# EAGLE design brain (EAGLE 5.01)
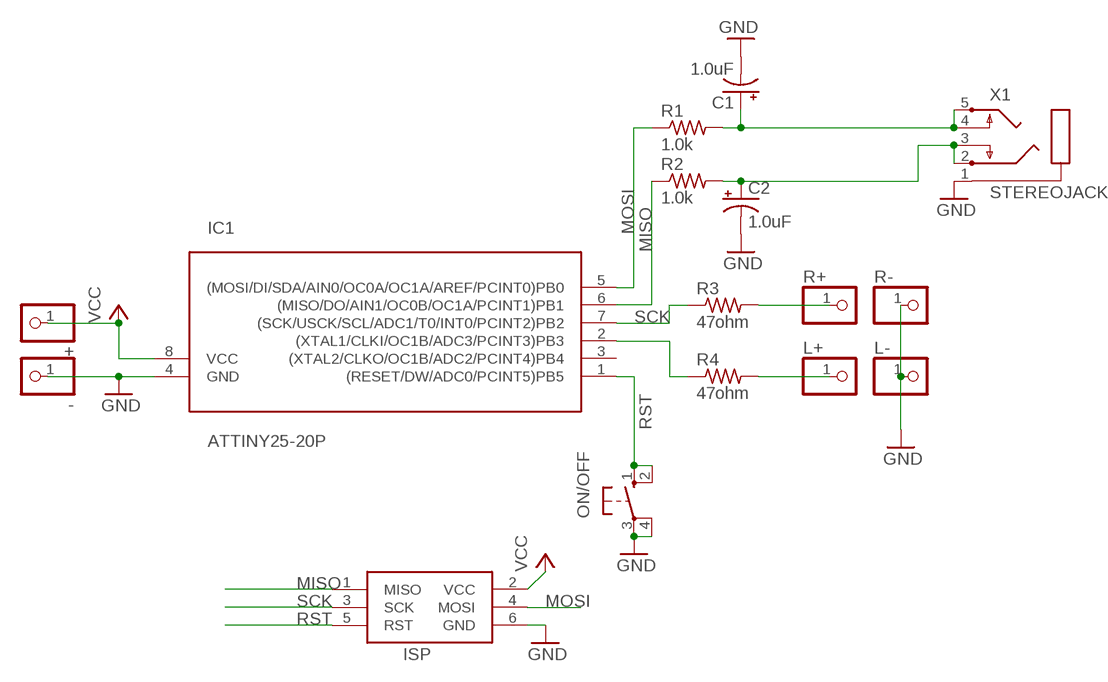
[diagram p0: schematic, sheet 1]

## Parts
+  PINHD-1X1  [1X01]
-  PINHD-1X1  [1X01]
C1  1.0uF  CPOL-USE2.5-5  [E2,5-5]
C2  1.0uF  CPOL-USE2.5-5  [E2,5-5]
IC1  ATTINY25-20P  [DIL08]
ISP  AVRISP-6  [AVRISP]
L+  PINHD-1X1  [1X01]
L-  PINHD-1X1  [1X01]
ON/OFF  10-XX  [B3F-10XX]
R1  1.0k  R-US_0207/10  [0207/10]
R2  1.0k  R-US_0207/10  [0207/10]
R3  47ohm  R-US_0207/10  [0207/10]
R4  47ohm  R-US_0207/10  [0207/10]
R+  PINHD-1X1  [1X01]
R-  PINHD-1X1  [1X01]
X1  STEREOJACK  [STX3100]

## Nets
GND: -.1 C1.- C2.- IC1.4(GND) ISP.6(GND) L-.1 ON/OFF.3(P) ON/OFF.4(P1) R-.1 X1.1
LEYE+: L+.1 R4.2
MISO: IC1.6((MISO/DO/AIN1/OC0B/OC1A/PCINT1)PB1) ISP.1(MISO) R2.1
MOSI: IC1.5((MOSI/DI/SDA/AIN0/OC0A/OC1A/AREF/PCINT0)PB0) ISP.4(MOSI) R1.1
N$1: C1.+ R1.2 X1.4 X1.5
N$3: C2.+ R2.2 X1.2 X1.3
N$8: IC1.2((XTAL1/CLKI/OC1B/ADC3/PCINT3)PB3) R4.1
N$9: R3.2 R+.1
RST: IC1.1((RESET/DW/ADC0/PCINT5)PB5) ISP.5(RST) ON/OFF.1(S) ON/OFF.2(S1)
SCK: IC1.7((SCK/USCK/SCL/ADC1/T0/INT0/PCINT2)PB2) ISP.3(SCK) R3.1
VCC: +.1 IC1.8(VCC) ISP.2(VCC)
Unconnected: IC1.3((XTAL2/CLKO/OC1B/ADC2/PCINT4)PB4)

## Library data of the parts
+ - L+ L- R+ R- = adafruit:PINHD-1X1: Pin header 1x1 for 0.1" spacing With round pins
C1 C2 = adafruit:CPOL-US: POLARIZED CAPACITOR, American symbol
IC1 = avr:ATTINY25: MICROCONTROLLER 2 Kbytes FLASH 128 bytes EEPROM 128 bytes RAM 4-channel 10 bit ADC USI
ISP = adafruit:AVRISP: AVR ISP HEADER Standard 6 pin header for AVR programming
ON/OFF = switch-omron:10-XX: OMRON SWITCH
R1-R4 = adafruit:R-US_: RESISTOR, American symbol
X1 = adafruit:STEREOJACK: MIC/HEADPHONE JACK Stereo jack with two switches. Kycon STX3100, CUI SJ1-3555NG and/or 4UCon 05544

## Board
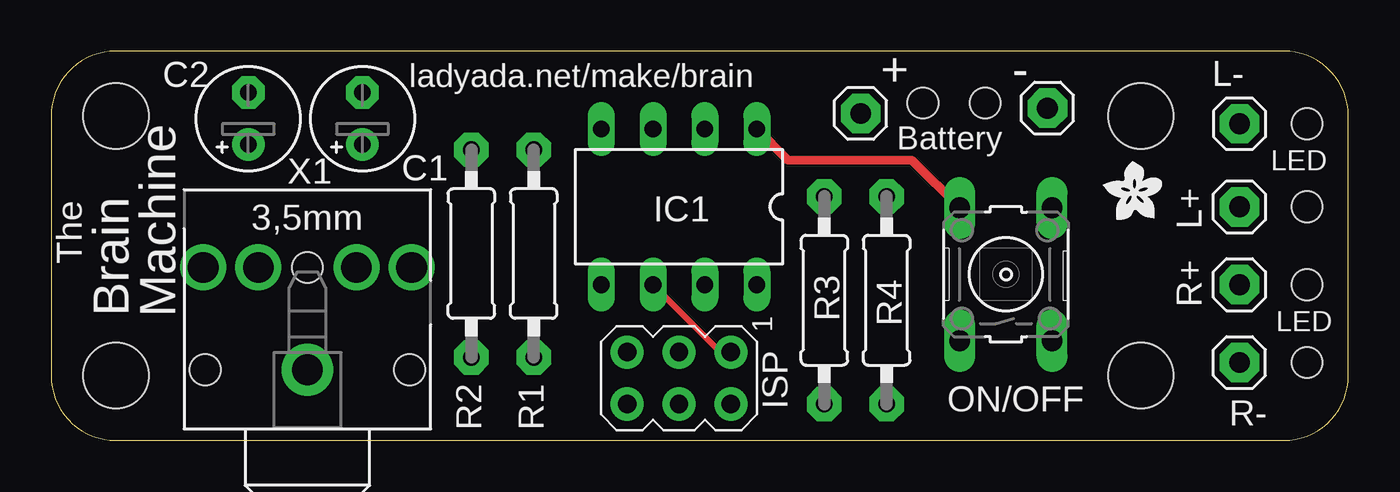
[diagram p1: board, top side]
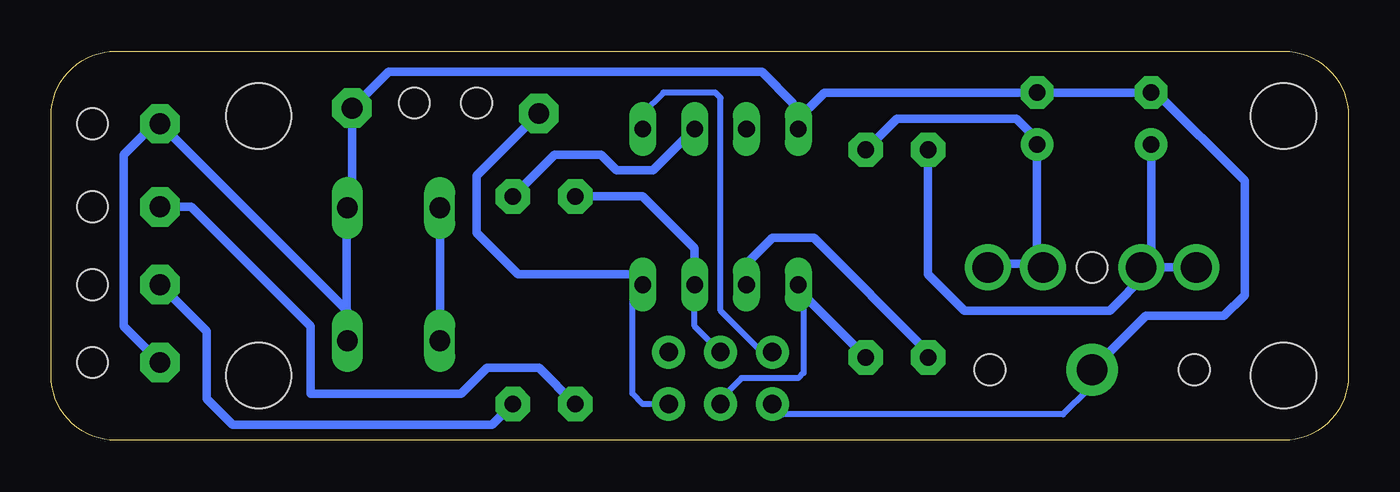
[diagram p2: board, bottom side, seen from below]

Size 63.5 x 19.05 mm. Coordinates in mm from the lower left corner, seen from the top.
Outline: 60.33,0 arc90 63.5,3.17 63.5,15.88 arc90 60.33,19.05 3.17,19.05 arc90 0,15.88 0,3.17 arc90 3.17,0 60.33,0
Copper layers (1*16): Top 0.035mm / dielectric 1.5mm / Bottom 0.035mm
Design rules "default *": minimum track width 10mil, minimum drill 19mil, track to track 12mil, track to pad 12mil, pad to pad 12mil, via to via 12mil, smd to smd 8mil, copper to edge 20mil, drill to drill 8mil, minimum pad ring 10mil, minimum via ring 8mil, stop-mask expansion 4mil, vias tented up to drill 0mil, thermal gap 10mil
Holes 3.2 mm at 3.17,3.17 3.17,15.88 53.34,15.88 53.34,3.17
Holes 1.5 mm at 45.72,16.51 42.67,16.51 61.47,15.49 61.47,11.43 61.47,7.62 61.47,3.81

### Footprints (pad centres in the part's own frame; a part is rotated, then mirrored left to right if it is on the bottom)
1X01 = drill 1.016 pad 1.93 octagon: 1 0,0
E2,5-5 = drill 0.813 pad 1.6 round: + -1.27,0 | drill 0.813 pad 1.6 octagon: - 1.27,0
DIL08 = drill 0.813 long: 1 -3.81,-3.81; 2 -1.27,-3.81; 3 1.27,-3.81; 4 3.81,-3.81; 5 3.81,3.81; 6 1.27,3.81; 7 -1.27,3.81; 8 -3.81,3.81
AVRISP = drill 0.9 pad 1.626 round: 1 -1.27,2.54; 2 1.27,2.54; 3 -1.27,0; 4 1.27,0; 5 -1.27,-2.54; 6 1.27,-2.54
B3F-10XX = drill 1.016 long: 1 -3.251,2.261; 2 3.251,2.261; 3 -3.251,-2.261; 4 3.251,-2.261
0207/10 = drill 0.813 pad 1.676 octagon: 1 -5.08,0; 2 5.08,0
STX3100 = drill 1.5 pad 2.54 round: 1 2.7,-0.1 | drill 1.5 round: 2 7.7,5; 3 7.7,2.3; 4 7.7,-2.5; 5 7.7,-5.2 | hole 1.5: 2.7,4.9; 2.7,-5.1; 7.7,-0.1

### Placement (x,y rotation side)
+  39.62,16 180 top
-  48.77,16.26 180 top
C1  15.24,15.75 90 top
C2  9.65,15.75 90 top
IC1  30.73,11.43 180 top
ISP  30.73,3.05 270 top
L+  58.17,7.62 90 top
L-  58.17,15.49 0 top
ON/OFF  46.74,8.13 90 top
R1  23.62,9.14 90 top
R2  20.57,9.14 90 top
R3  37.85,6.86 270 top
R4  40.89,6.86 270 top
R+  58.17,11.43 90 top
R-  58.17,3.81 180 top
U$1  [ADAFRUIT200MIL]  52.83,12.19 0 top
X1  12.45,0.76 90 top

### Tracks (layer width: path | path; a pad name or v marks a point on that pad's centre or on a via)
GND
  Bottom 0.305: ISP.6 27.69,1.27 13.97,1.27 12.7,2.54 12.7,3.31 X1.1
  Bottom 0.406: X1.1 9.91,6.1 6.1,6.1 5.08,7.11 5.08,12.7 9.4,17.02 C2.- C1.- | C1.- 15.49,17.02 | C1.- 25.65,17.02 27.18,15.49 | R-.1 59.94,5.59 59.94,13.97 58.42,15.49 L-.1 49,6.33 ON/OFF.3 49.02,4.9 49.02,11.4 | 49.02,11.4 49.02,11.68 | 49.02,11.4 ON/OFF.4 48.82,11.38 48.77,11.68 -.1 46.99,18.03 28.7,18.03 27.18,16.51 27.18,15.49 | 27.18,15.49 IC1.4
LEYE+
  Bottom 0.406: R4.2 41.91,0.76 54.61,0.76 55.88,2.03 55.88,5.33 57.91,7.37 58.17,7.37 L+.1
MISO
  Top 0.305: ISP.1 32.77,4.32 IC1.6
  Bottom 0.406: R2.1 20.57,4.32 26.16,9.91 28.19,9.91 29.46,8.64 IC1.6
MOSI
  Bottom 0.305: 26.92,7.37 26.67,7.11 26.67,3.3 26.92,3.05 29.72,3.05 30.99,1.78 ISP.4
  Bottom 0.406: IC1.5 26.92,7.37 R1.1
N$1
  Bottom 0.406: X1.4 14.91,8.46 14.73,8.64 15.24,8.64 | 15.24,8.64 C1.+ 15.24,14.73 16.26,15.75 22.1,15.75 R1.2 | 17.78,8.46 17.78,8.13 | 17.78,8.46 X1.5 | 15.24,8.64 17.78,8.64 17.78,8.46
N$3
  Bottom 0.406: 10.15,8.4 10.16,8.38 X1.3 | X1.3 10.15,8.4 | C2.+ 9.65,8.89 10.15,8.4 | R2.2 20.57,8.13 18.8,6.35 11.68,6.35 9.91,8.13 10.15,8.37 X1.3 | X1.3 | X1.2 X1.3
N$8
  Bottom 0.406: IC1.2 34.04,13.21 35.81,13.21 36.58,13.97 38.86,13.97 40.64,12.19 40.89,12.19 R4.1
N$9
  Bottom 0.406: R3.2 39.62,3.56 42.16,3.56 43.43,2.29 50.8,2.29 50.8,5.59 56.64,11.43 R+.1
RST
  Top 0.406: ON/OFF.2 42.14,13.72 36.07,13.72 IC1.1
  Bottom 0.305: ISP.5 28.45,4.06 30.73,6.35 30.73,16.76 30.99,17.02 33.53,17.02 34.54,16 IC1.1 34.54,14.99
  Bottom 0.406: 44.45,4.85 44.45,4.83 | 44.45,4.85 ON/OFF.1 | ON/OFF.2 44.45,11.35 44.45,4.85
SCK
  Bottom 0.305: ISP.3 32,5.59 32,7.87
  Bottom 0.406: R3.1 34.54,11.94 32,9.4 32,7.87 IC1.7
VCC
  Bottom 0.305: ISP.2 34.54,1.78 35.05,2.29 35.05,7.11 IC1.8
  Bottom 0.406: +.1 42.67,12.95 42.67,10.16 40.64,8.13 34.8,8.13 34.54,7.87 IC1.8

### Text on the board
tPlace: ladyada.net/make/brain | Machine | Battery | LED | The | Brain | LED